# Altium project IMU.PrjPCB
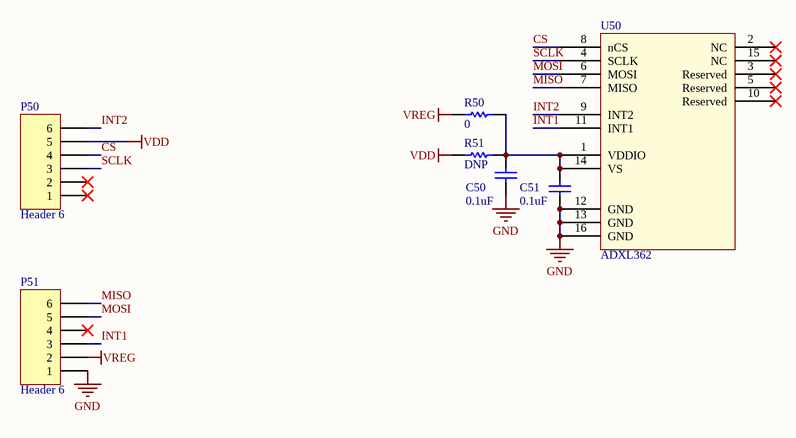
[diagram p0: IMU.SchDoc]
1 sheet, 7 parts. Net scope: global (net labels, ports and power ports of the same name join across sheets).
Board file: IMU.PcbDoc

## Sheet IMU.SchDoc: ICM20602 Test Board
size Letter; Author: Mohamad Katanbaf; Organization: University of Washington; Address1: Sensor Systems Lab; Address2: Paul Allen Center,; Address3: 185 E Stevens Way NE; Address4: Seattle, WA, 98105; Revision: 1.0; SheetNumber: 1; SheetTotal: 1

### Parts
C50  value 0.1uF  [0402]  (hidden comment: Generic ceramic capacitor)
C51  value 0.1uF  [0402]  (hidden comment: Generic ceramic capacitor)
P50  Header 6  [HDR1X6]
P51  Header 6  [HDR1X6]
R50  value 0  [0402]  (hidden comment: Generic resistor)
R51  value DNP  [0402]  (hidden comment: Generic resistor)
U50  ADXL362  [ADXL362]

### Nets
GND: C50.1 C51.1 P51.1 U50.12(GND) U50.13(GND) U50.16(GND)
VDD: P50.5 R51.1
VREG: P51.2 R50.1
CS: P50.4 U50.8(nCS)
INT1: P51.3 U50.11(INT1)
INT2: P50.6 U50.9(INT2)
MISO: P51.6 U50.7(MISO)
MOSI: P51.5 U50.6(MOSI)
SCLK: P50.3 U50.4(SCLK)
NetC50_2: C50.2 C51.2 R50.2 R51.2 U50.1(VDDIO) U50.14(VS)

Not connected (* = marked no-connect by the designer): P50 1* 2*; P51 4*; U50 2(NC)* 3(Reserved)* 5(Reserved)* 10(Reserved)* 15(NC)*

### Notes on the sheet
- Title
- Date:
- Project
- Revision:
- Sheet
- of
- Author:

### Library data of the parts
C50 C51 = C-0.1uF-10V-X5R-0402: CAP CER 100nF/0.1UF 10V X5R 0402; Manufacturer: Samsung Electro-Mechanics; Manufacturer Part Number: CL05A104KP5NNNC; Rating: 10V, -55C~85C; Tolerance: +-10%; Digi-Key Part Number: 1276-1022-1-ND; Note: *
P50 P51 = Header 6: Header, 6-Pin; LatestRevisionDate: 17-Jul-2002; LatestRevisionNote: Re-released for DXP Platform.; Publisher: Altium Limited
R50 = R-0-0.063W-*-0402: RES 0 OHM JUMPER 1/16W 0402; Manufacturer: YAGEO; Manufacturer Part Number: RC0402JR-070RL; Digi-Key Part Number: 311-0.0JRCT-ND; Rating: 1/16W; Note: *; Tolerance: *
R51 = res: Chip Resistor (Surface Mount); Manufacturer: *; Manufacturer Part Number: *; Digi-Key Part Number: *; Rating: *; Note: *; Tolerance: *
U50 = ADXL362: Analog Devices low power accelerometer; Manufacturer: Analog Devices Inc.; Manufacturer Part Number: ADXL362BCCZ-RL; Rating: 1.6~3.5V, -40~85C; Digi-Key Part Number: 505-ADXL362BCCZ-RLCT-ND; Note: *